# Altium schematic sheet temp.SchDoc
size A4; SheetNumber: 12; SheetTotal: 12
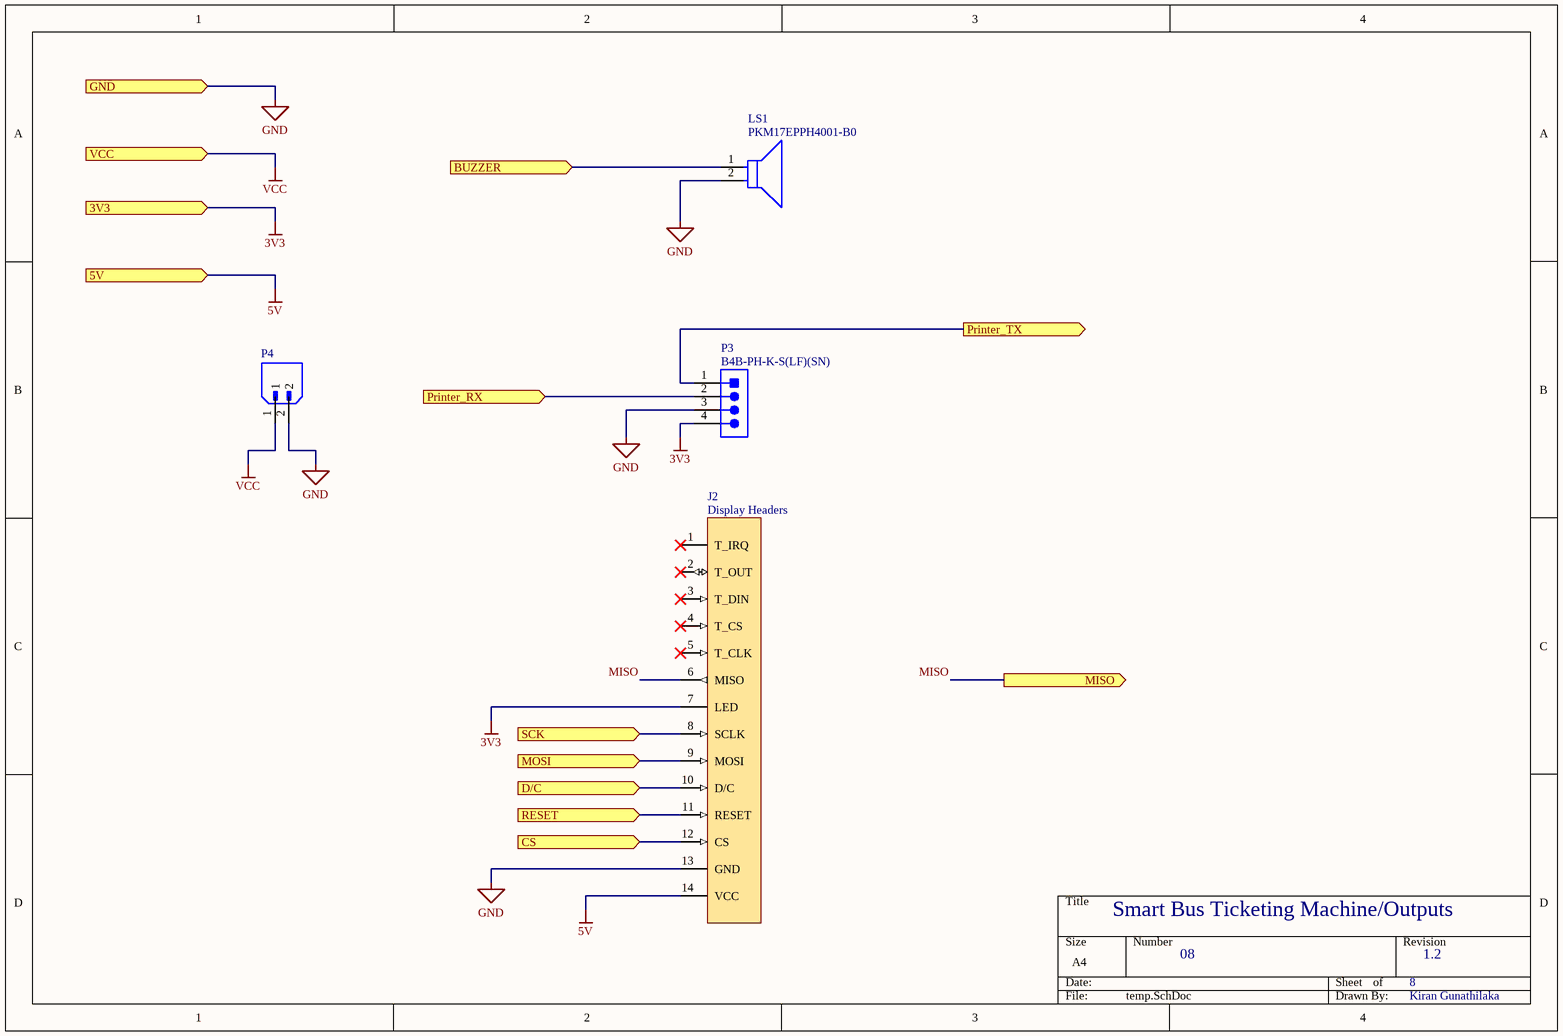
[diagram p0: temp.SchDoc]

## Parts
J2  Display Headers  [SULLINS_PPTC061LFBN-RC]
LS1  PKM17EPPH4001-B0  [FP-PKM17EPPH4001-B0-MFG]
P3  B4B-PH-K-S(LF)(SN)  [JST-B4B-PH-K-S_V]
P4  Battery Connector  [JST_B2B-XH-A(LF)(SN)]  (value not drawn)

## Ports
3V3 (in, see Outputs[2C], Display[1A], GPRS[1A], GPS[1A], IMU[1A], MCU[1B], Outputs[1A], PowerSupply[4A]), 5V (in, see Outputs[2C], Outputs[1A], PowerSupply[4A]), BUZZER (in, see Outputs[2B], MCU[4A], Outputs[1B]), CS (in, see Outputs[2C], MCU[4A], Outputs[1C]), D/C (in, see Outputs[2D], MCU[4A], Outputs[1D]), GND (in, see Outputs[2C], Buzzer[1A], Display[1A], GPRS[1A], GPS[1A], IMU[1A], MCU[1B], Outputs[1A], PowerSupply[4B]), MISO (out, see Outputs[3C], MCU[1A], Outputs[3C]), MOSI (in, see Outputs[2D], MCU[4A], Outputs[1D]), Printer_RX (in, see Outputs[2C], Outputs[1C]), Printer_TX (out, see Outputs[3C]), RESET (in, see Outputs[2D], MCU[4A], Outputs[1D]), SCK (in, see Outputs[2C], MCU[4A], Outputs[1C]), VCC (in, see Outputs[2C], Outputs[1A], PowerSupply[4A])

## Nets
3V3: J2.7(LED) P3.4 ; port 3V3
5V: J2.14(VCC) ; port 5V
GND: J2.13(GND) LS1.2 P3.3 P4.2 ; port GND
VCC: P4.1 ; port VCC
BUZZER: LS1.1 ; port BUZZER
CS: J2.12(CS) ; port CS
D/C: J2.10(D/C) ; port D/C
MISO: J2.6(MISO) ; port MISO
MOSI: J2.9(MOSI) ; port MOSI
Printer_RX: P3.2 ; port Printer_RX
Printer_TX: P3.1 ; port Printer_TX
RESET: J2.11(RESET) ; port RESET
SCK: J2.8(SCLK) ; port SCK

Not connected (* = marked no-connect by the designer): J2 1(T_IRQ)* 2(T_OUT)* 3(T_DIN)* 4(T_CS)* 5(T_CLK)*

## Notes on the sheet
- Smart Bus Ticketing Machine/Outputs
- 08
- 8
- 1.2
- Kiran Gunathilaka

## Library data of the parts
J2 = TFT-LCD-2.8'' Display Headers
LS1 = CMP-06202-000027-1: AUDIO PIEZO TRANSDUCER 25V TH; Capacitance: 7nF; Self Resonant Frequency: 4kHz; Voltage Rating: 3V; Washable: No; Package Quantity: 600; Height: 7mm; Radiation Hardening: No; Lead Free: Lead Free; Max Operating Temperature: 70°C; REACH SVHC: No SVHC; Packaging: Bulk; Min Operating Temperature: -20°C; Diameter: 17mm; Voltage Rating (DC): 25V; Max Frequency: 4kHz; Nominal Input Voltage: 3V; Mount: Through Hole; Max Supply Voltage: 25V; Frequency: 4kHz; Termination: Solder
P3 = CMP-2000-05165-1: Male Header, Pitch 2 mm, 1 x 4 Position, Height 6 mm, Tail Length 3.4 mm, -25 to 85 degC, RoHS, Bulk; Manufacturer: JST; No of Positions: 4; Style/Orientation: StraightHeader/Plug; Pitch: 2mm; Datasheet URL: http://datasheet.octopart.com/B4B-PH-K-S%28LF%29%28SN%29-JST-datasheet-10558886.pdf; Type: ShroudedHeader; Manufacturer URL: http://www.jst.com/home2.html; Termination: Crimp; Datasheet Version: Apr-09
P4 = TX_RX Header